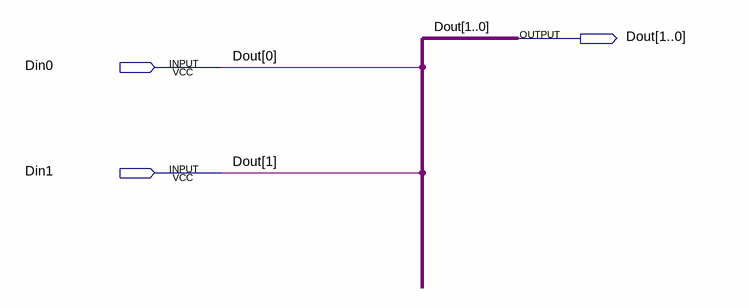
[diagram p0: schematic sheet]
// Quartus schematic cvt_1x2_2x1.bdf as structural Verilog: 0 symbols, 3 pins
module cvt_1x2_2x1 (
  input  Din0,
  input  Din1,
  output [1:0] Dout
);


  assign Dout = {Din1, Din0};
endmodule
